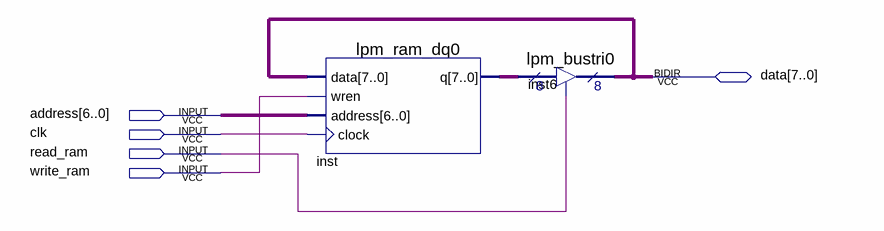
[diagram p0: schematic sheet]
// Quartus schematic ram.bdf as structural Verilog: 2 symbols, 5 pins
module ram (
  input  [6:0] address,
  input  clk,
  input  read_ram,
  input  write_ram,
  inout  [7:0] data
);

  wire [7:0] inst_q;

  lpm_ram_dq0 inst (.data(data), .wren(write_ram), .address(address), .clock(clk), .q(inst_q));
  lpm_bustri0 inst6 (.enabledt(read_ram), .data(inst_q), .tridata(data));
endmodule
